# EAGLE schematic UnoRover (EAGLE 7.3.0)
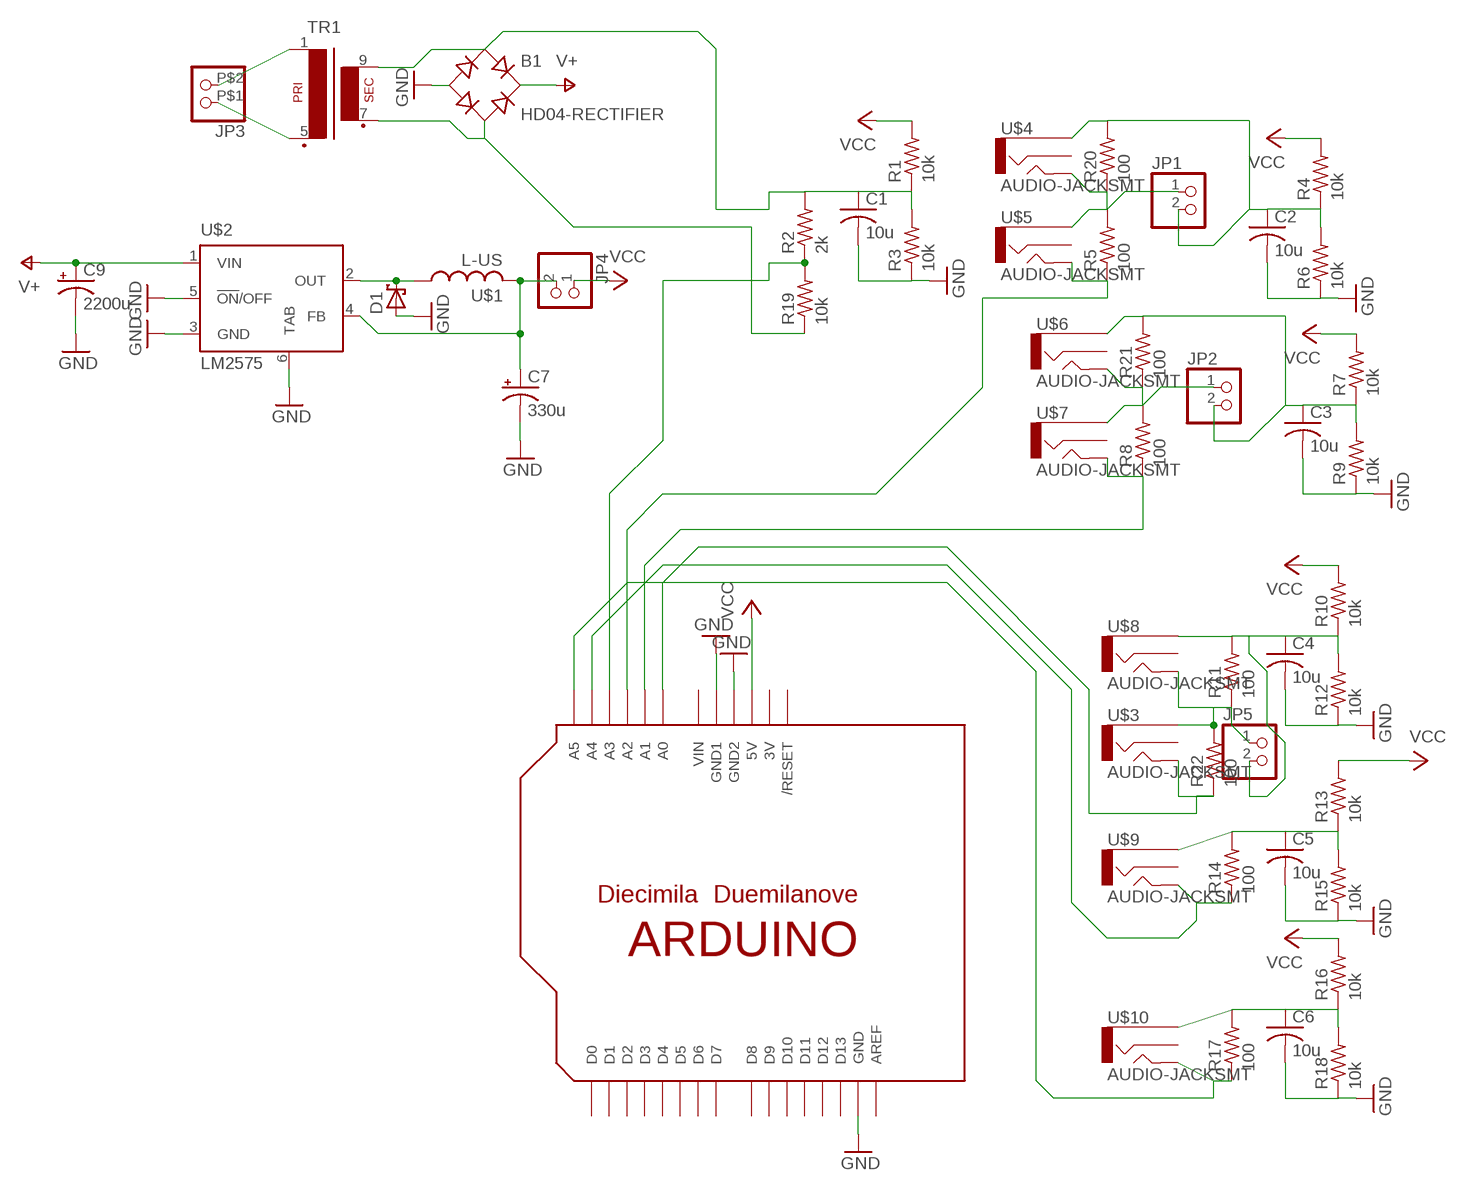
[diagram p0: schematic, sheet 1]

## Parts
B1  HD04-RECTIFIER  [MINIDIP-4]
C1  10u  C-USC0805  [C0805]
C2  10u  C-USC0805  [C0805]
C3  10u  C-USC0805  [C0805]
C4  10u  C-USC0805  [C0805]
C5  10u  C-USC0805  [C0805]
C6  10u  C-USC0805  [C0805]
C7  330u  CPOL-USE3.5-8  [E3,5-8]
C9  2200u  CPOL-USE5-13  [E5-13]
D1  SCHOTTKY-DIODE  [SOD123FL]
JP1  PINHD-1X2  [1X02]
JP2  PINHD-1X2  [1X02]
JP3  PINHD-1X25MM_TERMINAL  [5MM_TERMINAL]
JP4  PINHD-1X2  [1X02]
JP5  PINHD-1X2  [1X02]
R1  10k  R-US_M0805  [M0805]
R2  2k  R-US_M0805  [M0805]
R3  10k  R-US_M0805  [M0805]
R4  10k  R-US_M0805  [M0805]
R5  100  R-US_M0805  [M0805]
R6  10k  R-US_M0805  [M0805]
R7  10k  R-US_M0805  [M0805]
R8  100  R-US_M0805  [M0805]
R9  10k  R-US_M0805  [M0805]
R10  10k  R-US_M0805  [M0805]
R11  100  R-US_M0805  [M0805]
R12  10k  R-US_M0805  [M0805]
R13  10k  R-US_M0805  [M0805]
R14  100  R-US_M0805  [M0805]
R15  10k  R-US_M0805  [M0805]
R16  10k  R-US_M0805  [M0805]
R17  100  R-US_M0805  [M0805]
R18  10k  R-US_M0805  [M0805]
R19  10k  R-US_M0805  [M0805]
R20  100  R-US_M0805  [M0805]
R21  100  R-US_M0805  [M0805]
R22  100  R-US_M0805  [M0805]
TR1  EI30-1  [EI30-1]
U$1  L-US  [INDUCTOR_MURATA]
U$2  LM2575  [TO263-5]
U$3  AUDIO-JACKSMT  [SJ-3523-SMT-JACK]
U$4  AUDIO-JACKSMT  [SJ-3523-SMT-JACK]
U$5  AUDIO-JACKSMT  [SJ-3523-SMT-JACK]
U$6  AUDIO-JACKSMT  [SJ-3523-SMT-JACK]
U$7  AUDIO-JACKSMT  [SJ-3523-SMT-JACK]
U$8  AUDIO-JACKSMT  [SJ-3523-SMT-JACK]
U$9  AUDIO-JACKSMT  [SJ-3523-SMT-JACK]
U$10  AUDIO-JACKSMT  [SJ-3523-SMT-JACK]
U$11  ARDUINODUEMILANOVE  [ARDUINO]

## Nets
GND: B1.P$4(-) C1.2 C2.2 C3.2 C4.2 C5.2 C6.2 C7.- C9.- D1.A R3.1 R6.1 R9.1 R12.1 R15.1 R18.1 U$2.3(GND) U$2.5(!ON!/OFF) U$2.6(TAB) U$11.GND U$11.GND1 U$11.GND2
N$1: B1.P$1(AC1) C1.1 R1.1 R2.2 R3.2 TR1.9(S4)
N$3: R2.1 R19.2 U$11.A3
N$4: C3.1 JP2.2 R7.1 R9.2 R21.2 U$6.P$1
N$6: JP3.P$2 TR1.1
N$7: C5.1 R13.1 R14.2 R15.2 U$9.P$1
N$8: R14.1 U$9.P$2 U$11.A4
N$9: C4.1 JP5.2 R10.1 R11.2 R12.2 U$8.P$1
N$10: R22.1 U$3.P$2 U$11.A0
N$11: C6.1 R16.1 R17.2 R18.2 U$10.P$1
N$12: R17.1 U$10.P$2 U$11.A5
N$13: B1.P$2(AC2) R19.1 TR1.7(S3)
N$14: D1.C U$1.P$1 U$2.2(OUT)
N$15: C2.1 JP1.2 R4.1 R6.2 R20.2 U$4.P$1
N$16: JP1.1 R5.2 R20.1 U$4.P$2 U$5.P$1
N$17: JP2.1 R8.2 R21.1 U$6.P$2 U$7.P$1
N$18: JP3.P$1 TR1.5(P2)
N$19: C7.+ JP4.2 U$1.P$3 U$2.4(FB)
N$20: JP5.1 R11.1 R22.2 U$3.P$1 U$8.P$2
N$21: R8.1 U$7.P$2 U$11.A1
N$22: R5.1 U$5.P$2 U$11.A2
V+: B1.P$3(+) C9.+ U$2.1(VIN)
VCC: JP4.1 R1.2 R4.2 R7.2 R10.2 R13.2 R16.2 U$11.5V
Unconnected: U$3.P$3 U$4.P$3 U$5.P$3 U$6.P$3 U$7.P$3 U$8.P$3 U$9.P$3 U$10.P$3 U$11.AREF U$11.D0 U$11.D1 U$11.D2 U$11.D3 U$11.D4 U$11.D5 U$11.D6 U$11.D7 U$11.D8 U$11.D9 U$11.D10 U$11.D11 U$11.D12 U$11.D13 U$11.RESET(/RESET)

## Power pins joined to a net without a drawn wire
3V: U$11.3V
VIN: U$11.VIN

## Library data of the parts
B1 = jmengel:HD04-RECTIFIER: Single Phase 1.0 AMP Glass Passivated Bridge Rectifier Taiwan Semiconductor Co.,Ltd. - TSC Source: http://www.taiwansemi.com/TSCbig5/ezcatfiles/cust/img/img/db101g.pdf http://www.ts.com.tw/db/pictures/modules/PDT/PDT060207001/DBLS201G.pdf
C1-C6 = rcl:C-US: CAPACITOR, American symbol
C7 C9 = rcl:CPOL-US: POLARIZED CAPACITOR, American symbol
D1 = jmengel_old:SCHOTTKY-DIODE: Schottky Diode
JP1 JP2 JP5 = pinhead:PINHD-1X2: PIN HEADER
JP3 JP4 = jmengel:PINHD-1X2: PIN HEADER
R1-R22 = rcl:R-US_: RESISTOR, American symbol
TR1 = jmengel:EI30-1: TRANSFORMER 1 primary winding, 1 secondary winding ERA
U$1 = jmengel:L-US
U$2 = national-semiconductor:LM2575
U$3-U$10 = jmengel:AUDIO-JACK: 3.5mm Audio Jack Simple 3.5mm common PCB mount audio jack. SKU: PRT-08032
U$11 = jmengel:ARDUINO: Arduino Diecimila/Duemilanove Make a shield with ease, this package has all the named pins as well as the two mounting drill holes and an outline of the USB and DC power connector. The outline is on the DIMENSION layer, so if your board house uses it they will cut the outline to match. http://www.ladyada.net/library/pcb/eaglelibrary.html